# EAGLE design headstage-64-coax-adapter_rev1.2 (EAGLE 9.5.1)
DESIGNER: Jon Newman; DESIGN_NAME: Headstage-64 Coax Adapter; LICENSE: CERN OHL v1.2; REVISION: 1.0
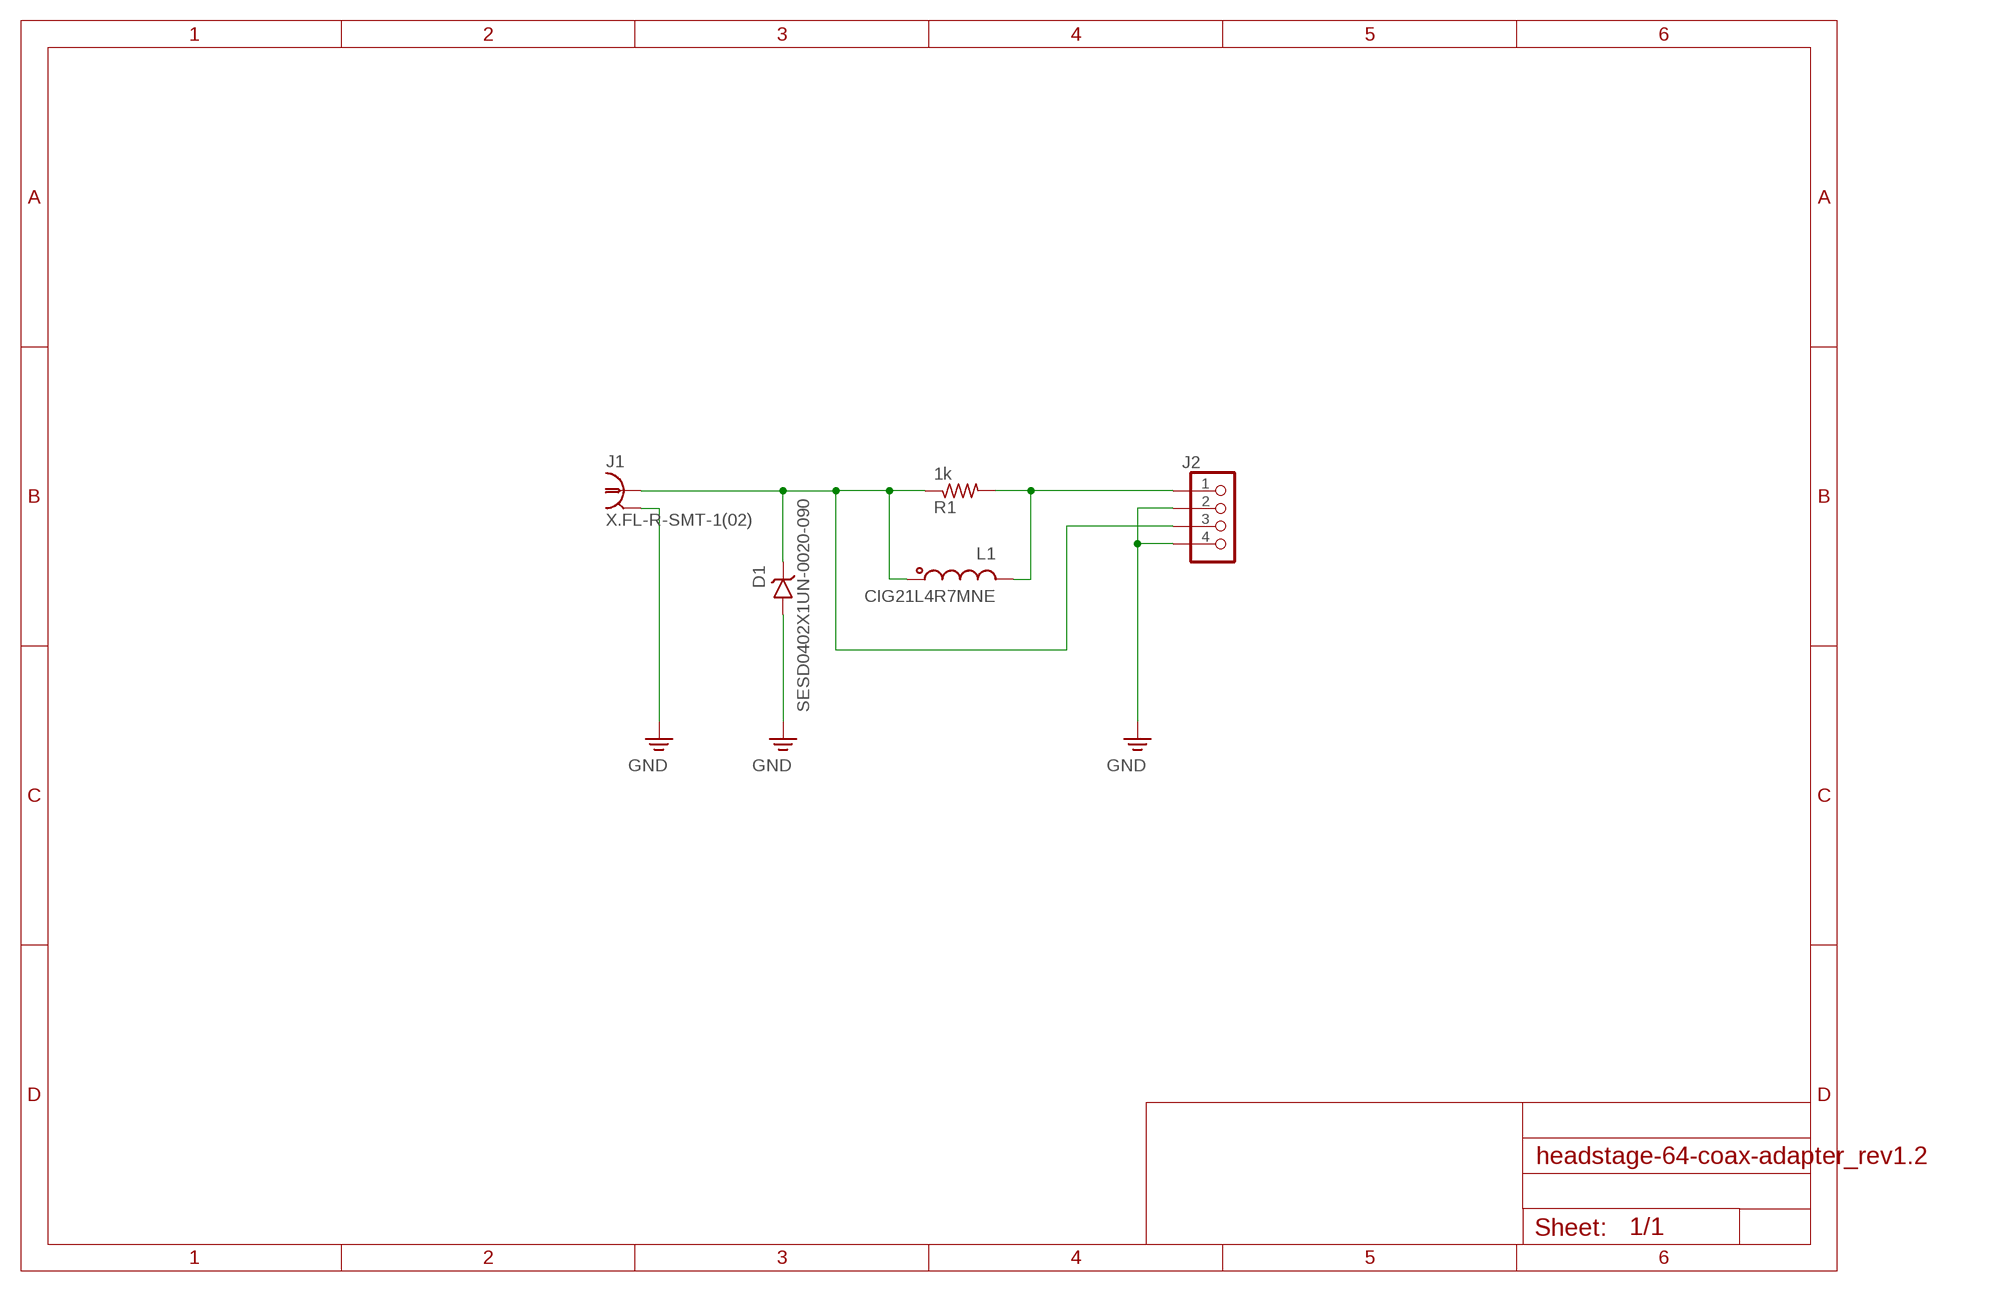
[diagram p0: schematic, sheet 1]

## Parts
D1  SESD0402X1UN-0020-090  Z-DIODE_0402T-DFN  [0402T-DFN]
J1  X.FL-R-SMT-1(02)  COAX_XFL  [X_FL_R_SMT_1(02)]
J2  PINHD-1X4HEADSTAGE64-DAUGHTER-CARD-CASTELLATED  [HEADSTAGE64-DAUGHER-CARD-CASTELLATED]
L1  CIG21L4R7MNE  L_0805T  [0805T]
R1  1k  R_0201T  [0201T]

## Nets
_SIGOUT1: D1.C J1.P$1 J2.3 L1.1 R1.1
GND: D1.A J1.P$2 J1.P$3 J1.P$4 J2.2 J2.4
N$48: J2.1 L1.2 R1.2

## Library data of the parts
D1 = jonnew:Z-DIODE: Zener Diode
J1 = jonnew:COAX: COAX CONNECTOR - Edge mount BNC - Vertical BNC - Vertical SMA - etc
J2 = jonnew:PINHD-1X4
L1 = jonnew:L: Inductor
R1 = jonnew:R: Resistor

## Board
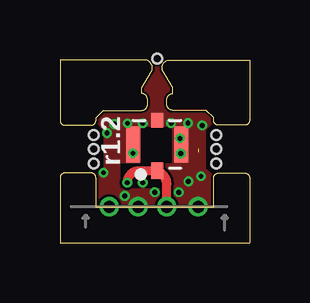
[diagram p1: board, top side]
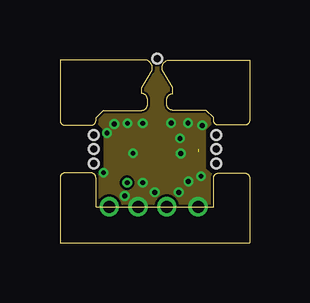
[diagram p2: board, inner layer Route2]
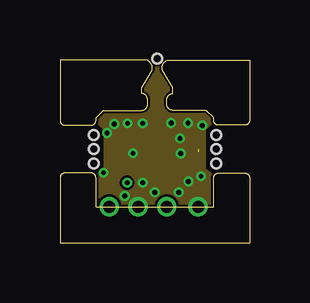
[diagram p3: board, inner layer Route15]
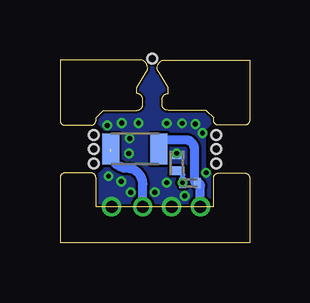
[diagram p4: board, bottom side, seen from below]

Size 7.9 x 7.62 mm. Coordinates in mm from the lower left corner, seen from the top.
Outline: 1.5,1.5 6.4,1.5 6.4,2.7 arc-90 6.6,2.9 7.7,2.9 arc-90 7.9,2.7 7.9,0 0,0 0,2.7 arc-90 0.2,2.9 1.3,2.9 arc-90 1.5,2.7 1.5,1.5
Outline: 1.8,5.52 1.5,5.22 1.5,5.1 arc-90 1.3,4.9 0.2,4.9 arc-90 0,5.1 0,7.62 3.6,7.62 arc-71 3.85,7.28 arc-45 3.77,7.09 3.4,6.47 3.4,6.22 arc-90 3.65,5.97 3.65,5.77 arc-90 3.4,5.52 1.8,5.52
Outline: 6.4,5.22 6.1,5.52 4.7,5.52 arc-90 4.45,5.77 4.45,5.97 arc-90 4.7,6.22 4.7,6.47 4.33,7.09 arc-45 4.25,7.28 arc-71 4.5,7.62 7.9,7.62 7.9,5.1 arc-90 7.7,4.9 6.6,4.9 arc-90 6.4,5.1 6.4,5.22
Copper layers (1*2*15*16): Top 0.035mm / dielectric 0.2mm / Route2 0.0175mm / dielectric 0.3mm / Route15 0.0175mm / dielectric 0.2mm / Bottom 0.035mm
Design rules "seeed-studio-4-layer *": minimum track width 4mil, minimum drill 0.2mm, track to track 4mil, track to pad 4mil, pad to pad 4mil, via to via 4mil, smd to smd 0mil, copper to edge 0.1mm, drill to drill 10mil, minimum pad ring 6mil, minimum via ring 4mil, stop-mask expansion 4mil, vias tented up to drill 100mil, thermal gap 10mil
Holes 0.4 mm at 4.05,7.67 1.4,4.5 1.4,3.9 1.4,3.3 6.5,4.5 6.5,3.9 6.5,3.3

### Footprints (pad centres in the part's own frame; a part is rotated, then mirrored left to right if it is on the bottom)
0402T-DFN = smd 0.35 x 0.6: A -0.325,0; C 0.325,0
X_FL_R_SMT_1(02) = smd 0.5 x 0.7: P$1 0,-1.1 | smd 0.6 x 1.5: P$2 -1,0; P$4 1,0 | smd 0.5 x 0.6: P$3 0,1
HEADSTAGE64-DAUGHER-CARD-CASTELLATED = drill 0.5: 1 -2.4,0; 2 -1.2,0; 3 0,0; 4 1.3,0
0805T = smd 0.7 x 1.3: 1 -1,0; 2 1,0
0201T = smd 0.3 x 0.4: 1 -0.3,0; 2 0.3,0

### Placement (x,y rotation side)
D1  3.03,3.33 270 bottom
J1  4.05,4.1 0 top
J2  4.45,1.5 0 top
L1  4.78,3.91 0 bottom
R1  2.48,2.49 0 bottom

### Tracks (layer width: path | path; a pad name or v marks a point on that pad's centre or on a via)
_SIGOUT1  (via drill 0.2)  (1 unrouted)
  Top 0.37: J2.3 4.45,2.45 arc90 3.9,3 J1.P$1 3.3,3 arc90 v2.8,2.5
  Bottom 0.127: R1.1 R1.1 arc90 v2.8,2.5
  Bottom 0.2: R1.1 2.78,2.83 D1.C
  Bottom 0.37: J2.3 4.45,2.45 arc-90 5.1,3.1 arc90 5.78,3.78
C1
  cutout Top: 1.6,4.9 1.8,4.7 1.8,3.1 1.6,2.9 1.3,2.9 1.3,4.9
  cutout Route2: 1.6,4.9 1.8,4.7 1.8,3.1 1.6,2.9 1.3,2.9 1.3,4.9
  cutout Route15: 1.6,4.9 1.8,4.7 1.8,3.1 1.6,2.9 1.3,2.9 1.3,4.9
  cutout Bottom: 1.6,4.9 1.8,4.7 1.8,3.1 1.6,2.9 1.3,2.9 1.3,4.9
C2
  cutout Route2: 6.3,4.9 6.1,4.7 6.1,3.1 6.3,2.9 6.6,2.9 6.6,4.9
C3
  cutout Route15: 6.3,4.9 6.1,4.7 6.1,3.1 6.3,2.9 6.6,2.9 6.6,4.9
C4
  cutout Bottom: 6.3,4.9 6.1,4.7 6.1,3.1 6.3,2.9 6.6,2.9 6.6,4.9
C5
  cutout Top: 6.3,4.9 6.1,4.7 6.1,3.1 6.3,2.9 6.6,2.9 6.6,4.9
GND  (via drill 0.2)
  other vias: 3.04,3.73 3.95,2.1 1.81,2.92 5.03,3.72 3.45,4.98 2.81,4.98 5.35,2.55 4.95,2.1 5,4.35 4.63,4.99 1.96,4.57 2.26,4.95 5.93,4.89 3.45,2.5 2.7,1.95 5.88,2.77 5.33,4.99
  pour Bottom (isolate 0.02, rank 2, no thermals): 1.5,7.84 6.4,7.84 6.4,1.5 1.5,1.5
  pour Route15 (isolate 0.02, rank 2, no thermals): 1.5,7.84 6.4,7.84 6.4,1.5 1.5,1.5
  pour Top (isolate 0.02, rank 2, no thermals): 1.5,7.84 6.4,7.84 6.4,1.5 1.5,1.5
  pour Route15 (isolate 0.02, rank 2, no thermals): 1.5,7.84 6.4,7.84 6.4,1.5 1.5,1.5
  pour Route2 (isolate 0.02, rank 2, no thermals): 1.5,7.84 6.4,7.84 6.4,1.5 1.5,1.5
N$48
  Bottom 0.37: L1.2 3.78,4.01 3.49,4.3 2.7,4.3 arc90 2.3,3.9 2.3,2.61 arc-90 R1.2 arc90 2.05,2.36 J2.1
N$49
  cutout Top: 4.2,2.28 2.54,2.28 2.54,3.3 3.85,3.3 4.2,2.59

### Text on the board
tPlace: r1.2